# EAGLE schematic MasterBoard (EAGLE 5.11)
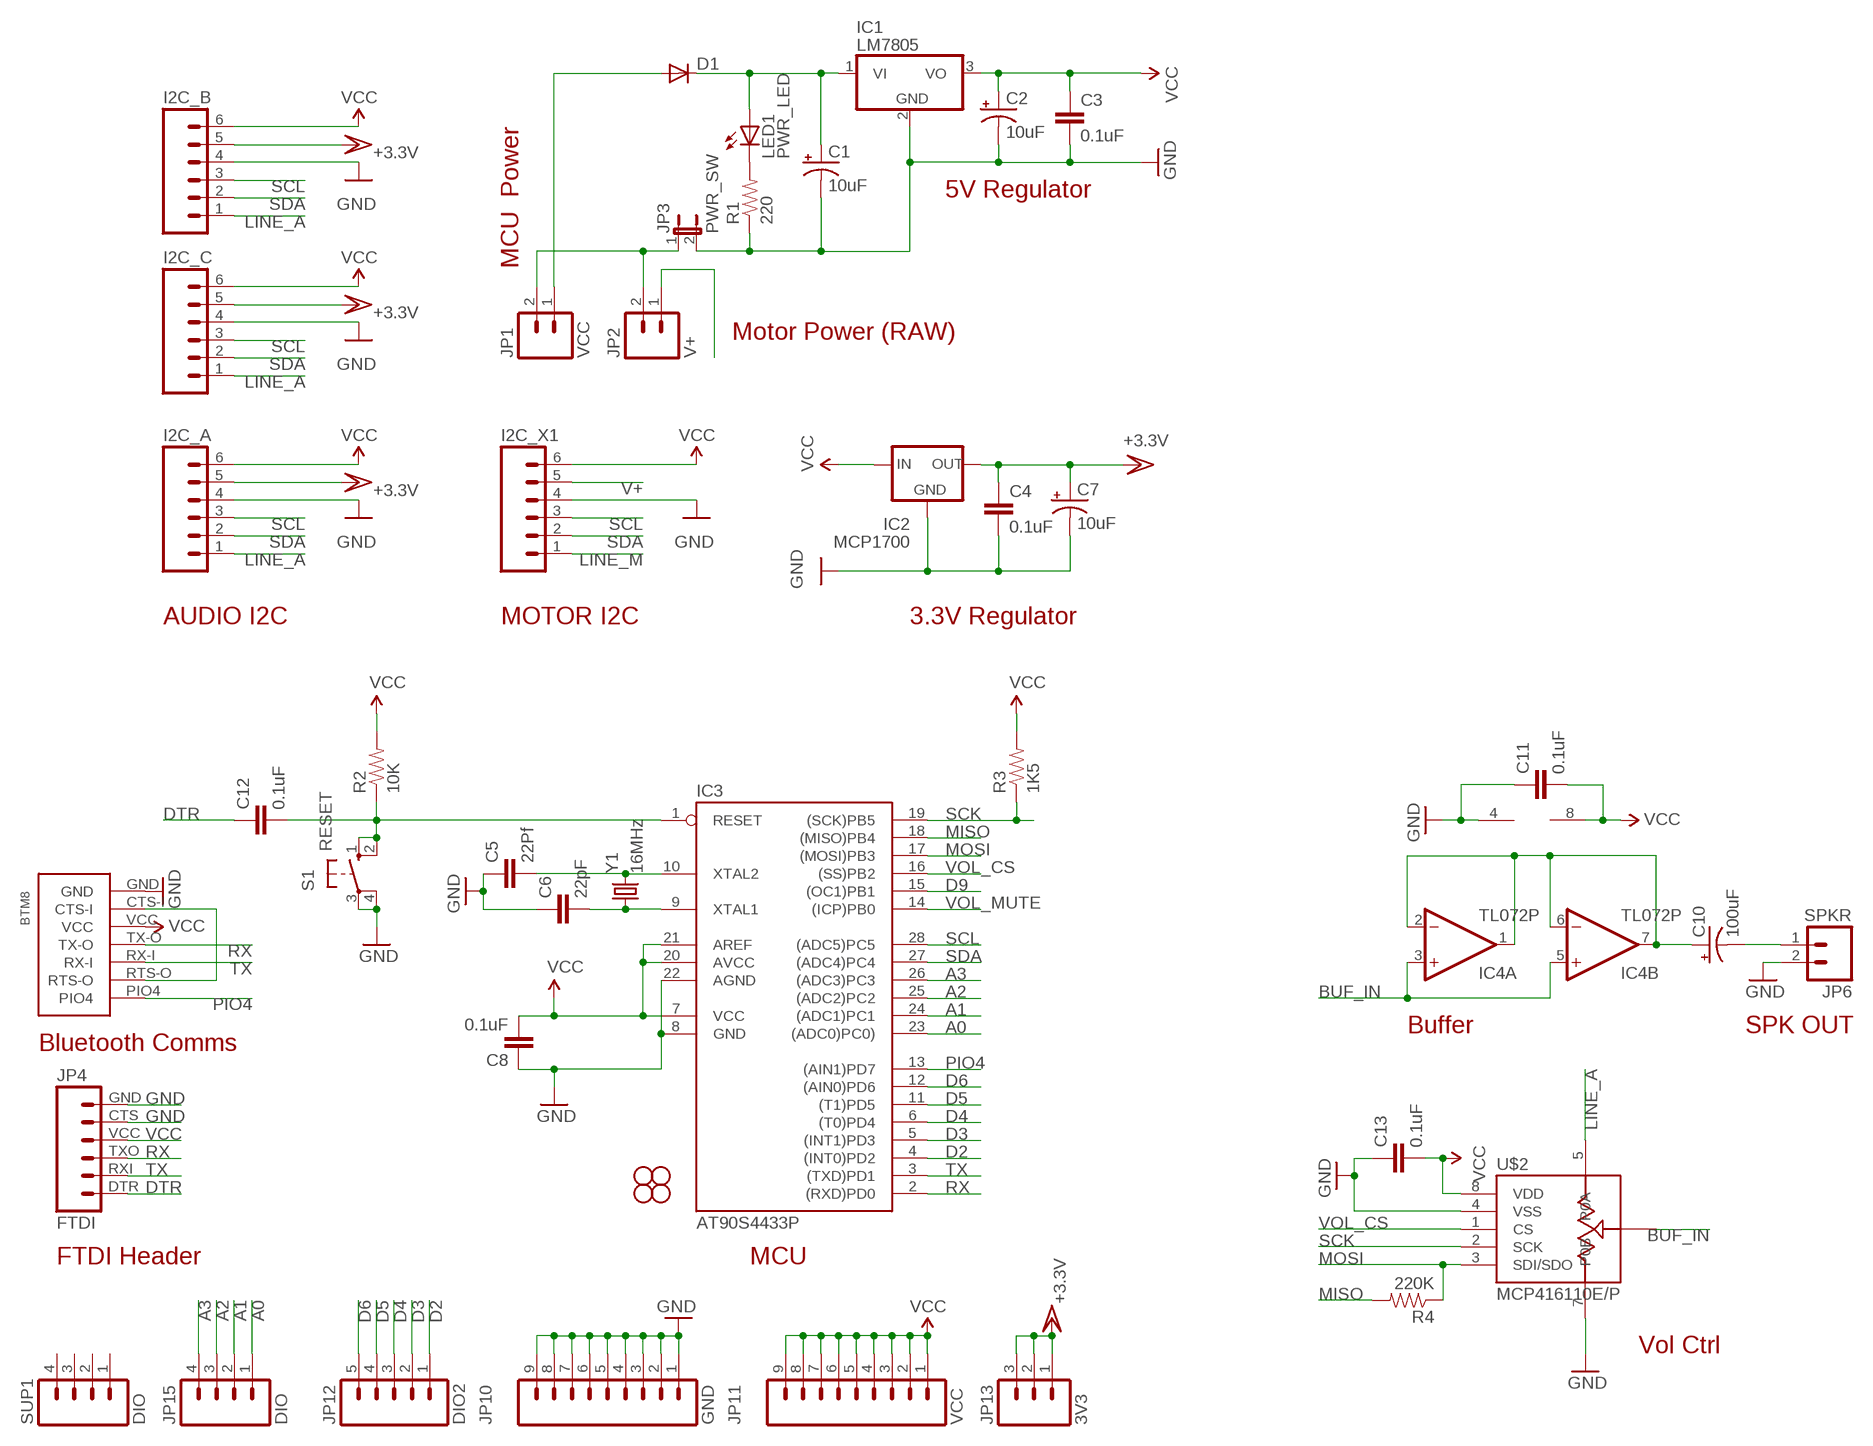
[diagram p0: schematic, sheet 1]

## Parts
BTM8  BLUETOOTH_MATE_SILVER  BLUETOOTH_MATE90FEMALE  [BLUETOOTH_MATE_90FEMALE]
C1  10uF  CAP_POLPTH2  [CPOL-RADIAL-10UF-25V]
C2  10uF  CAP_POLPTH2  [CPOL-RADIAL-10UF-25V]
C3  0.1uF  CAPPTH  [CAP-PTH-SMALL]
C4  0.1uF  CAPPTH  [CAP-PTH-SMALL]
C5  22Pf  CAPPTH  [CAP-PTH-SMALL]
C6  22pF  CAPPTH  [CAP-PTH-SMALL]
C7  10uF  CAP_POLPTH2  [CPOL-RADIAL-10UF-25V]
C8  0.1uF  CAPPTH  [CAP-PTH-SMALL]
C10  100uF  CAP_POLPTH2  [CPOL-RADIAL-10UF-25V]
C11  0.1uF  CAPPTH  [CAP-PTH-SMALL]
C12  0.1uF  CAPPTH  [CAP-PTH-SMALL]
C13  0.1uF  CAPPTH  [CAP-PTH-SMALL]
D1  DIODE1N4148  [DIODE-1N4148]
I2C_A  M06POLAR_LOCK  [MOLEX-1X6_LOCK]
I2C_B  M06POLAR_LOCK  [MOLEX-1X6_LOCK]
I2C_C  M06POLAR_LOCK  [MOLEX-1X6_LOCK]
I2C_X1  M06POLAR_LOCK  [MOLEX-1X6_LOCK]
IC1  LM7805  7805TV  [TO220V]
IC2  MCP1700  MCP1700INLINE  [TO92-INLINE]
IC3  AT90S4433P  [DIL28-3]
IC4  TL072P  [DIL08]
JP1  VCC  M02POLAR_LOCK  [MOLEX-1X2_LOCK]
JP2  V+  M02POLAR_LOCK  [MOLEX-1X2_LOCK]
JP3  PWR_SW  JUMPER-2PTH  [1X02]
JP4  FTDI  FTDI_BASICPTH  [FTDI_BASIC]
JP5  STAND-OFF  [STAND-OFF]
JP6  SPKR  M02POLAR_LOCK  [MOLEX-1X2_LOCK]
JP7  STAND-OFF  [STAND-OFF]
JP8  STAND-OFF  [STAND-OFF]
JP9  STAND-OFF  [STAND-OFF]
JP10  GND  M09LOCK  [1X09_LOCK]
JP11  VCC  M09LOCK  [1X09_LOCK]
JP12  DIO2  M05LOCK  [1X05_LOCK]
JP13  3V3  M03LOCK  [1X03_LOCK]
JP15  DIO  M04LOCK  [1X04_LOCK]
LED1  PWR_LED  LED3MM  [LED3MM]
R1  220  RESISTORPTH-1/4W  [AXIAL-0.4]
R2  10K  RESISTORAXIAL-0.3  [AXIAL-0.3]
R3  1K5  RESISTORPTH-1/4W  [AXIAL-0.4]
R4  220K  RESISTORAXIAL-0.3  [AXIAL-0.3]
S1  RESET  10-XX  [B3F-10XX]
SUP1  DIO  M04LOCK  [1X04_LOCK]
U$2  MCP416110E/P  [DIL08]
Y1  16MHz  CRYSTALHC49US  [HC49US]

## Nets
A0: IC3.23((ADC0)PC0)) JP15.1
A1: IC3.24((ADC1)PC1) JP15.2
A2: IC3.25((ADC2)PC2) JP15.3
A3: IC3.26((ADC3)PC3) JP15.4
BUF_IN: IC4.3(A:+IN) IC4.5(B:+IN) U$2.6(P0W)
D2: IC3.4((INT0)PD2) JP12.1
D3: IC3.5((INT1)PD3) JP12.2
D4: IC3.6((T0)PD4) JP12.3
D5: IC3.11((T1)PD5) JP12.4
D6: IC3.12((AIN0)PD6) JP12.5
D9: IC3.15((OC1)PB1)
DTR: C12.1 JP4.DTR
GND [power]: BTM8.GND C1.2(-) C2.2(-) C3.2 C4.2 C5.1 C6.1 C7.2(-) C8.1 C11.1 C13.1 I2C_A.4 I2C_B.4 I2C_C.4 I2C_X1.4 IC1.2(GND) IC2.1(GND) IC3.8(GND) IC3.22(AGND) IC4.4(P:V-) JP3.2 JP4.CTS JP4.GND JP6.2 JP10.1 JP10.2 JP10.3 JP10.4 JP10.5 JP10.6 JP10.7 JP10.8 JP10.9 R1.P$1 S1.3(P) S1.4(P1) U$2.4(VSS) U$2.7(P0B)
LINE_A: I2C_A.1 I2C_B.1 I2C_C.1 U$2.5(P0A)
LINE_M: I2C_X1.1
MISO: IC3.18((MISO)PB4) R4.P$2
MOSI: IC3.17((MOSI)PB3) R4.P$1 U$2.3(SDI/SDO)
N$2: C12.2 IC3.1(RESET) R2.P$1 S1.1(S) S1.2(S1)
N$3: D1.A JP1.1
N$4: C1.1(+) D1.C IC1.1(VI) LED1.A
N$5: C10.2(-) JP6.1
N$6: LED1.K(C) R1.P$2
N$7: JP1.2 JP2.2 JP3.1
N$8: C10.1(+) IC4.1(A:OUT) IC4.2(A:-IN) IC4.6(B:-IN) IC4.7(B:OUT)
N$10: BTM8.CTS-I BTM8.RTS-O
PIO4: BTM8.PIO4 IC3.13((AIN1)PD7)
RX: BTM8.TX-O IC3.2((RXD)PD0) JP4.TXO
SCK: IC3.19((SCK)PB5) R3.P$1 U$2.2(SCK)
SCL: I2C_A.3 I2C_B.3 I2C_C.3 I2C_X1.3 IC3.28((ADC5)PC5)
SDA: I2C_A.2 I2C_B.2 I2C_C.2 I2C_X1.2 IC3.27((ADC4)PC4)
TX: BTM8.RX-I IC3.3((TXD)PD1) JP4.RXI
V+ [power]: I2C_X1.5 JP2.1
VCC: BTM8.VCC C2.1(+) C3.1 C8.2 C11.2 C13.2 I2C_A.6 I2C_B.6 I2C_C.6 I2C_X1.6 IC1.3(VO) IC2.2(IN) IC3.7(VCC) IC3.20(AVCC) IC3.21(AREF) IC4.8(P:V+) JP4.VCC JP11.1 JP11.2 JP11.3 JP11.4 JP11.5 JP11.6 JP11.7 JP11.8 JP11.9 R2.P$2 R3.P$2 U$2.8(VDD)
VCC/2: C4.1 C7.1(+) I2C_A.5 I2C_B.5 I2C_C.5 IC2.3(OUT) JP13.1 JP13.2 JP13.3 ; supply symbol labelled +3.3V
VOL_CS: IC3.16((SS)PB2) U$2.1(CS)
VOL_MUTE: IC3.14((ICP)PB0)
XTAL1: C6.2 IC3.9(XTAL1) Y1.1
XTAL2: C5.2 IC3.10(XTAL2) Y1.2
Unconnected: SUP1.1 SUP1.2 SUP1.3 SUP1.4

## Notes on the sheet
- MCU  Power
- 5V Regulator
- Motor Power (RAW)
- AUDIO I2C | MOTOR I2C | 3.3V Regulator
- Buffer | SPK OUT
- Bluetooth Comms
- FTDI Header | MCU
- Vol Ctrl

## Library data of the parts
BTM8 = Dek:BLUETOOTH_MATE
C1 C2 C7 C10 = SparkFun:CAP_POL: Capacitor Polarized These are standard SMD and PTH capacitors. Normally 10uF, 47uF, and 100uF in electrolytic and tantalum varieties. Always verify the external diameter of the through hole cap, it varies with capacity, voltage, and manufacturer. The EIA devices should be standard.
C3-C6 C8 C11-C13 = SparkFun:CAP: Capacitor Standard 0603 ceramic capacitor, and 0.1" leaded capacitor.
D1 = SparkFun:DIODE: Diode These are standard reverse protection diodes and small signal diodes. SMA package can handle up to about 1A. SOD-323 can handle about 200mA. What the SOD-323 package when ordering, there are some mfgs out there that are 5-pin packages.
I2C_A I2C_B I2C_C I2C_X1 = SparkFun:M06: Header 6 Standard 6-pin 0.1" header. Use with straight break away headers (SKU : PRT-00116), right angle break away headers (PRT-00553), swiss pins (PRT-00743), machine pins (PRT-00117), and female headers (PRT-00115). Molex polarized connector foot print use with SKU : PRT-08094 with associated crimp pins and housings. NOTES ON THE VARIANTS LOCK and LOCK_LONGPADS... This footprint was designed to help hold the alignment of a through-hole component (i.e. 6-pin header) while soldering it into place. You may notice that each hole has been shifted either up or down by 0.005 of an inch from it's more standard position (which is a perfectly straight line). This slight alteration caused the pins (the squares in the middle) to touch the edges of the holes. Because they are alternating, it causes a "brace" to hold the component in place. 0.005 has proven to be the perfect amount of "off-center" position when using our standard breakaway headers. Although looks a little odd when you look at the bare footprint, once you have a header in there, the alteration is very hard to notice. Also, if you push a header all the way into place, it is covered up entirely on the bottom side. This idea of altering the position of holes to aid alignment will be further integrated into the Sparkfun Library for other footprints. It can help hold any component with 3 or more connection pins.
IC1 = linear:78*: Positive VOLTAGE REGULATOR Source: http://cache.national.com/ds/LM/LM78L05.pdf http://www.fairchildsemi.com/ds/LM/LM7805.pdf
IC2 = adafruit:MCP1700: VOLTAGE REGULATOR
IC3 = atmel:AT90S4433: MICROCONTROLLER 4 Kbytes FLASH 128 bytes SRAM 256 bytes EEPROM UART 6-channel 10 bit ADC; OC_FARNELL: unknown; OC_NEWARK: unknown
IC4 = linear:TL072: OP AMP
JP1 JP2 JP6 = SparkFun:M02: Header 2 Standard 2-pin 0.1" header. Use with straight break away headers (SKU : PRT-00116), right angle break away headers (PRT-00553), swiss pins (PRT-00743), machine pins (PRT-00117), and female headers (PRT-00115). Molex polarized connector foot print use with SKU : PRT-08233 with associated crimp pins and housings.
JP3 = SparkFun:JUMPER-2: Jumper Basic 0.1" spaced jumper. Use with breakaway headers.
JP4 = SparkFun:FTDI_BASIC: FTDI Basic: 3.3V and 5V
JP5 JP7-JP9 = SparkFun:STAND-OFF: Stand Off This is the mechanical footprint for a #4 phillips button head screw. Use the keepout ring to avoid running the screw head into surrounding components. SKU : PRT-00447
JP10 JP11 = SparkFun:M09: Header 9 Standard 9-pin 0.1" header. Use with straight break away headers (SKU : PRT-00116), right angle break away headers (PRT-00553), swiss pins (PRT-00743), machine pins (PRT-00117), and female headers (PRT-00115).
JP12 = SparkFun:M05: Header 5 Standard 5-pin 0.1" header. Use with straight break away headers (SKU : PRT-00116), right angle break away headers (PRT-00553), swiss pins (PRT-00743), machine pins (PRT-00117), and female headers (PRT-00115). Molex polarized connector foot print use with SKU : PRT-08230 with associated crimp pins and housings.
JP13 = SparkFun:M03: Header 3 Standard 3-pin 0.1" header. Use with straight break away headers (SKU : PRT-00116), right angle break away headers (PRT-00553), swiss pins (PRT-00743), machine pins (PRT-00117), and female headers (PRT-00115). Molex polarized connector foot print use with SKU : PRT-08232 with associated crimp pins and housings.
JP15 SUP1 = SparkFun:M04: Header 4 Standard 4-pin 0.1" header. Use with straight break away headers (SKU : PRT-00116), right angle break away headers (PRT-00553), swiss pins (PRT-00743), machine pins (PRT-00117), and female headers (PRT-00115). Molex polarized connector foot print use with SKU : PRT-08231 with associated crimp pins and housings. 1MM SMD Version SKU: PRT-10208
LED1 = SparkFun:LED: LEDs Standard schematic elements and footprints for 5mm, 3mm, 1206, and 0603 sized LEDs. 5mm - Spark Fun Electronics SKU : COM-00529 (and others)
R1-R4 = SparkFun:RESISTOR: Resistor Basic schematic elements and footprints for 0603, 1206, and PTH resistors.
S1 = switch-omron:10-XX: OMRON SWITCH; MPN: B3F-1000; OC_FARNELL: 176432; OC_NEWARK: 36M3542
U$2 = Dek:MCP4161
Y1 = SparkFun:CRYSTAL: Crystals Various standard crystals. Proven footprints. Spark Fun Electronics SKU : COM-00534

## Net classes
1 power: width 0.813 mm, clearance 0.508 mm